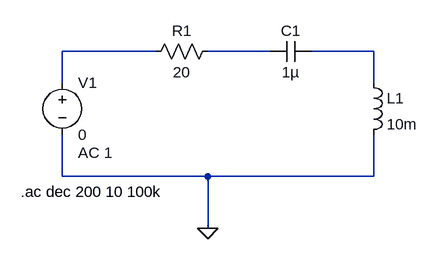
[diagram p0: schematic RLC Series.asc]
RLC Series.asc, the LTspice schematic file:
Version 4.1
SHEET 1 880 680
WIRE 128 80 -16 80
WIRE 304 80 208 80
WIRE 464 80 368 80
WIRE -16 128 -16 80
WIRE 464 128 464 80
WIRE -16 272 -16 208
WIRE 208 272 -16 272
WIRE 464 272 464 208
WIRE 464 272 208 272
WIRE 208 352 208 272
FLAG 208 352 0
SYMBOL voltage -16 112 R0
WINDOW 123 24 124 Left 2
WINDOW 39 0 0 Left 0
SYMATTR InstName V1
SYMATTR Value 0
SYMATTR Value2 AC 1
SYMBOL res 224 64 R90
WINDOW 0 0 56 VBottom 2
WINDOW 3 32 56 VTop 2
SYMATTR InstName R1
SYMATTR Value 20
SYMBOL cap 368 64 R90
WINDOW 0 0 32 VBottom 2
WINDOW 3 32 32 VTop 2
SYMATTR InstName C1
SYMATTR Value 1µ
SYMBOL ind 448 112 R0
SYMATTR InstName L1
SYMATTR Value 10m
TEXT -80 296 Left 2 !.ac dec 200 10 100k

The netlist it stands for:
* RLC Series.asc
V1 N001 0 0 AC 1
R1 N002 N001 20
C1 N003 N002 1µ
L1 N003 0 10m
.ac dec 200 10 100k
.backanno
.end